# EAGLE schematic Atemfrequenzmesser_Schematic_V2 (EAGLE 9.6.2)
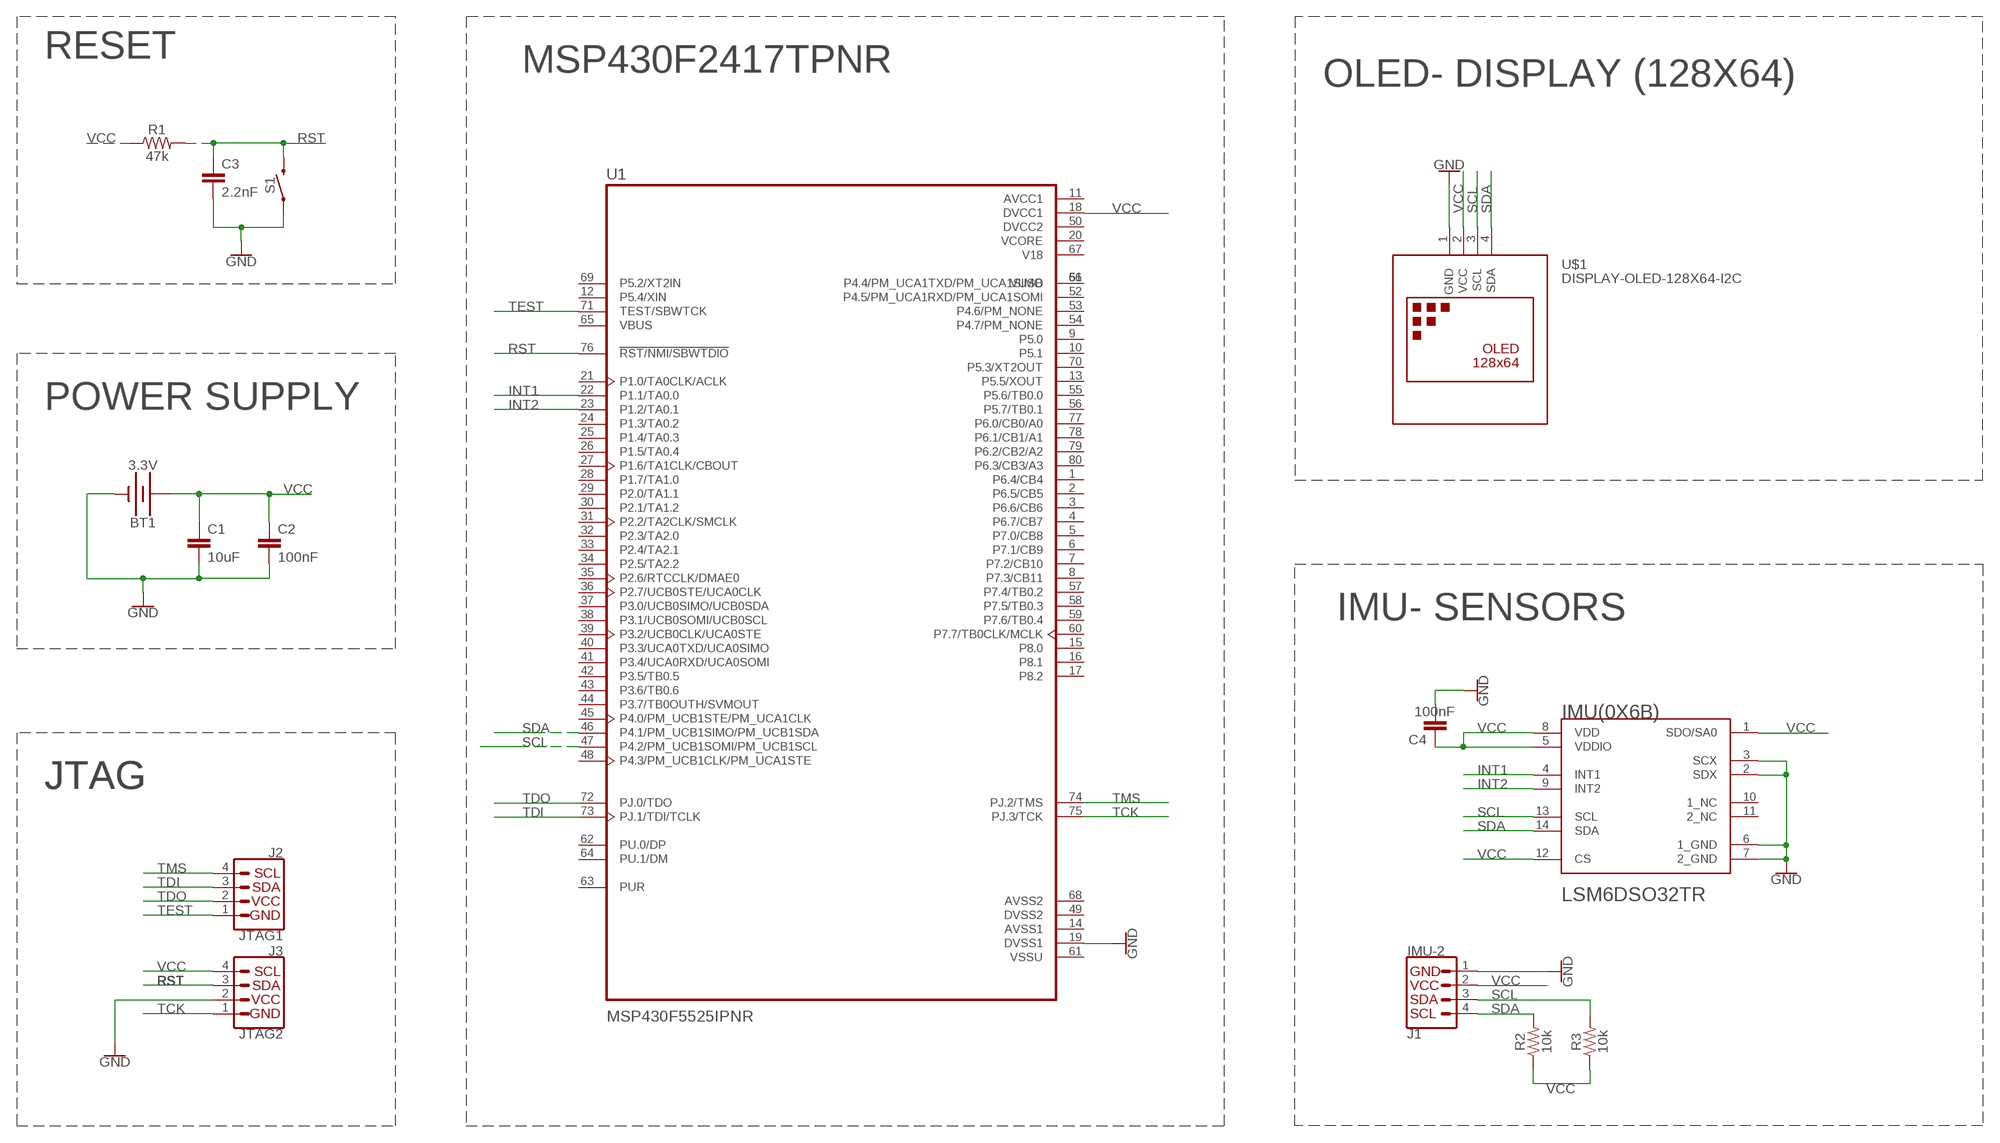
[diagram p0: schematic, sheet 1]

## Parts
BT1  3.3V  BATTERY-20MM_PTH  [BATTCOM_20MM_PTH]
C1  10uF  1.0PF-0603-50V-25%  [0603]
C2  100nF  1.0PF-0603-50V-25%  [0603]
C3  2.2nF  1.0PF-0603-50V-25%  [0603]
C4  100nF  1.0PF-0603-50V-25%  [0603]
IMU(0X6B)  STMICROELECTRONICS_LSM6DSO32TRSTMICROELECTRONICS_LSM6DSO32TR_0_0  [STMICROELECTRONICS_LSM6DSO32TR_0]
J1  IMU-2  I2C_STANDARDQWIIC  [JST04_1MM_RA]
J2  JTAG1  I2C_STANDARDQWIIC  [JST04_1MM_RA]
J3  JTAG2  I2C_STANDARDQWIIC  [JST04_1MM_RA]
R1  47k  1KOHM-0603-1/10W-1%  [0603]
R2  10k  1KOHM-0603-1/10W-1%  [0603]
R3  10k  1KOHM-0603-1/10W-1%  [0603]
S1  MOMENTARY-SWITCH-SPST-PTH-6.0MM  [TACTILE_SWITCH_PTH_6.0MM]
U1  MSP430F5525IPNR  MSP430F5519IPNR  [QFP50P1400X1400X160-80N]
U$1  DISPLAY-OLED-128X64-I2C  [DISPLAY-OLED-128X64-I2C]

## Nets
GND: BT1.2(-) C1.2 C2.2 C3.2 C4.2 IMU(0X6B).2(SDX) IMU(0X6B).3(SCX) IMU(0X6B).6(1_GND) IMU(0X6B).7(2_GND) J1.1 J3.2 S1.1 U1.19(DVSS1) U$1.1(GND)
INT1: IMU(0X6B).4(INT1) U1.22(P1.1/TA0.0)
INT2: IMU(0X6B).9(INT2) U1.23(P1.2/TA0.1)
RST: C3.1 J3.3 R1.2 S1.3 U1.76(!RST/NMI/SBWTDIO)
SCL: IMU(0X6B).13(SCL) J1.3 R3.2 U1.47(P4.2/PM_UCB1SOMI/PM_UCB1SCL) U$1.3(SCL)
SDA: IMU(0X6B).14(SDA) J1.4 R2.2 U1.46(P4.1/PM_UCB1SIMO/PM_UCB1SDA) U$1.4(SDA)
TCK: J3.1 U1.75(PJ.3/TCK)
TDI: J2.3 U1.73(PJ.1/TDI/TCLK)
TDO: J2.2 U1.72(PJ.0/TDO)
TEST: J2.1 U1.71(TEST/SBWTCK)
TMS: J2.4 U1.74(PJ.2/TMS)
VCC: BT1.1(+) C1.1 C2.1 C4.1 IMU(0X6B).1(SDO/SA0) IMU(0X6B).5(VDDIO) IMU(0X6B).8(VDD) IMU(0X6B).12(CS) J1.2 J3.4 R1.1 R2.1 R3.1 U1.18(DVCC1) U$1.2(VCC)
Unconnected: IMU(0X6B).10(1_NC) IMU(0X6B).11(2_NC) U1.1(P6.4/CB4) U1.2(P6.5/CB5) U1.3(P6.6/CB6) U1.4(P6.7/CB7) U1.5(P7.0/CB8) U1.6(P7.1/CB9) U1.7(P7.2/CB10) U1.8(P7.3/CB11) U1.9(P5.0) U1.10(P5.1) U1.12(P5.4/XIN) U1.13(P5.5/XOUT) U1.15(P8.0) U1.16(P8.1) U1.17(P8.2) U1.21(P1.0/TA0CLK/ACLK) U1.24(P1.3/TA0.2) U1.25(P1.4/TA0.3) U1.26(P1.5/TA0.4) U1.27(P1.6/TA1CLK/CBOUT) U1.28(P1.7/TA1.0) U1.29(P2.0/TA1.1) U1.30(P2.1/TA1.2) U1.31(P2.2/TA2CLK/SMCLK) U1.32(P2.3/TA2.0) U1.33(P2.4/TA2.1) U1.34(P2.5/TA2.2) U1.35(P2.6/RTCCLK/DMAE0) U1.36(P2.7/UCB0STE/UCA0CLK) U1.37(P3.0/UCB0SIMO/UCB0SDA) U1.38(P3.1/UCB0SOMI/UCB0SCL) U1.39(P3.2/UCB0CLK/UCA0STE) U1.40(P3.3/UCA0TXD/UCA0SIMO) U1.41(P3.4/UCA0RXD/UCA0SOMI) U1.42(P3.5/TB0.5) U1.43(P3.6/TB0.6) U1.44(P3.7/TB0OUTH/SVMOUT) U1.45(P4.0/PM_UCB1STE/PM_UCA1CLK) U1.48(P4.3/PM_UCB1CLK/PM_UCA1STE) U1.51(P4.4/PM_UCA1TXD/PM_UCA1SIMO) U1.52(P4.5/PM_UCA1RXD/PM_UCA1SOMI) U1.53(P4.6/PM_NONE) U1.54(P4.7/PM_NONE) U1.55(P5.6/TB0.0) U1.56(P5.7/TB0.1) U1.57(P7.4/TB0.2) U1.58(P7.5/TB0.3) U1.59(P7.6/TB0.4) U1.60(P7.7/TB0CLK/MCLK) U1.62(PU.0/DP) U1.63(PUR) U1.64(PU.1/DM) U1.65(VBUS) U1.66(VUSB) U1.69(P5.2/XT2IN) U1.70(P5.3/XT2OUT) U1.77(P6.0/CB0/A0) U1.78(P6.1/CB1/A1) U1.79(P6.2/CB2/A2) U1.80(P6.3/CB3/A3)

## Notes on the sheet
- RESET
- MSP430F2417TPNR
- OLED- DISPLAY (128X64)
- POWER SUPPLY
- IMU- SENSORS
- JTAG | JTAG

## Power pins joined to a net without a drawn wire
AVCC1: U1.11(AVCC1)
AVSS1: U1.14(AVSS1)
AVSS2: U1.68(AVSS2)
DVCC2: U1.50(DVCC2)
DVSS2: U1.49(DVSS2)
V18: U1.67(V18)
VCORE: U1.20(VCORE)
VSSU: U1.61(VSSU)

## Library data of the parts
BT1 = SparkFun-Batteries1:BATTERY: Battery - Single Cell A variety of battery chemistries, sizes, and footprints. Device List: 20MM_PTH - Coin Cell Battery Holder - 20mm (PTH) <https://www.sparkfun.com/products/783> 6.8MM_PTH - Coin Cell Battery Holder - 6.8MM(SMD) <https://www.digikey.com/product-detail/en/seiko-instruments/MS621FE-FL11E/728-1057-ND/1889208?WT.srch=1&gclid=CNOQ5a6LzdQCFZS2wAodXCkE0g> 12MM_SMD - Coin Cell Battery Holder - 12mm (SMD) <https://www.sparkfun.com/products/10592> 12MM_PTH - Coin Cell Battery Holder - 12mm (PTH) <https://www.sparkfun.com/products/7948> 20MM_SMD - 20mm Coin Cell Battery Holder (SMD) (2 legs) Used on the Big Time Watch Kit <https://www.sparkfun.com/products/11734> 20MM_SMD_4LEGS - Coin Cell Battery Holder - 20mm (SMD) <https://www.sparkfun.com/products/11892> 20MM_SMD_4LEGS_OVERPASTE - Coin Cell Battery Holder - 20mm (SMD) <https://www.sparkfun.com/products/11892> (Over-paste on the legs) 24.5MM_PTH - Coin Cell Battery Holder - 24.5mm (PTH) <https://www.sparkfun.com/products/8863> 9V - 9V Battery Holder - PC Mount Used on the SparkFun SparkPunk Sound Kit <https://www.sparkfun.com/products/11177> and SparkFun SparkPunk Sequencer Kit <https://www.sparkfun.com/products/12707> 18650 - Battery Holder - 18650 (PTH) <https://www.sparkfun.com/products/13113> AA - Battery Holder - 1xAA (PTH) <https://www.sparkfun.com/products/7949> AAA - Battery Holder - 1xAAA (PTH) <https://www.sparkfun.com/products/12718> AA_KIT - Battery Holder - 1xAA (PTH) <https://www.sparkfun.com/products/7949> Special kit package - pads only have exposed copper on one side of the board. AAA_KIT - Battery Holder - 1xAAA (PTH) <https://www.sparkfun.com/products/12718> Special kit package - pads only have exposed copper on one side of the board.; PROD_ID: BATT-09031; SF_SKU: PRT-00783
C1-C4 = SparkFun-Capacitors:1.0PF: 1pF ceramic capacitors A capacitor is a passive two-terminal electrical component used to store electrical energy temporarily in an electric field.; PROD_ID: CAP-07879; VALUE: 1.0pF
IMU(0X6B) = STMicroelectronics - LSM6DSO32TR:STMICROELECTRONICS_LSM6DSO32TR: Accelerometer, Gyroscope, Temperature, 6 Axis Sensor I²C, SPI Output; ACCEL_RANGE: 4/8/16/32g; AUTOMOTIVE: No; CENTROID_NOT_SPECIFIED: No; DATASHEET: https://eu.mouser.com/datasheet/2/389/dm00603953-1862087.pdf; DEVICE_CLASS_L1: Sensors; DEVICE_CLASS_L2: Motion Sensors; DEVICE_CLASS_L3: Inertial Measurement Units (IMUs); DIGIKEY_DESCRIPTION: INEMO INERTIAL MODULE: 3D ACCELE; DIGIKEY_PART_NUMBER: 497-LSM6DSO32CT-ND; FOOTPRINT_VARIANT_NAME_0: Recommended_Land_Pattern; HEIGHT: 0.86mm; LEAD_FREE: Yes; MAX_SUPPLY_VOLTAGE: 3.6V; MF: STMicroelectronics; MFG_PACKAGE_IDENT: LGA-14L-DM00249496; MFG_PACKAGE_IDENT_COMPONENT_ID: 648051b55531c14c; MFG_PACKAGE_IDENT_DATE: 0; MFG_PACKAGE_IDENT_REV: 1; MIN_SUPPLY_VOLTAGE: 1.62V; MOUSER_DESCRIPTION: Accelerometer and 3D Gyroscope 3D Always-On 1.71V to 3.6V 0.55mA 14-Pin LGA T/R; MOUSER_PART_NUMBER: 511-LSM6DSO32TR; MPN: LSM6DSO32TR; OPERATING_SUPPLY_CURRENT: 0.55mA; PACKAGE: LGA14; PREFIX: U; RESOLUTION: 16bits; ROHS: Yes; SENSOR_OUTPUT: I2C,SPI; SENSOR_TYPE: Temperature,Accelerometer,Gyroscope; TEMPERATURE_RANGE_HIGH: +85°C; TEMPERATURE_RANGE_LOW: -40°C; VERIFICATION_VERSION: 0.0.0.3
J1-J3 = SparkFun-Connectors:I2C_STANDARD: SparkFun I2C Standard Pinout Header SparkFun has standardized on a pinout for all I2C based sensor breakouts. This pinout allows I2C boards to be plugged directly into the headers on Arduino Uno compatible boards, and to be daisy chained easily. Example SparkFun Products: SparkFun Atmospheric Sensor Breakout - BME280 <https://www.sparkfun.com/products/13676> SparkFun Altitude/Pressure Sensor Breakout - MPL3115A2 <https://www.sparkfun.com/products/11084> SparkFun TOF Range Finder Sensor - VL6180 <https://www.sparkfun.com/products/12785>; PROD_ID: CONN-13694; VALUE: Qwiic Right Angle
R1-R3 = SparkFun-Resistors:1KOHM: 1kΩ resistor A resistor is a passive two-terminal electrical component that implements electrical resistance as a circuit element. Resistors act to reduce current flow, and, at the same time, act to lower voltage levels within circuits. - Wikipedia; PROD_ID: RES-07856; VALUE: 1k
S1 = SparkFun-Switches1:MOMENTARY-SWITCH-SPST: Momentary Switch (Pushbutton) - SPST Normally-open (NO) SPST momentary switches (buttons, pushbuttons). Variants PTH-12MM - 12mm square, through-hole Momentary Pushbutton Switch - 12mm Square <https://www.sparkfun.com/products/9190> (COM-09190) PTH-6.0MM, PTH-6.0MM-KIT - 6.0mm square, through-hole Mini Pushbutton Switch <https://www.sparkfun.com/products/97> (COM-00097) KIT package intended for soldering kit's - only one side of pads' copper is exposed. PTH-RIGHT-ANGLE-KIT - Right-angle, through-hole Right Angle Tactile Button <https://www.sparkfun.com/products/10791> - Used on SparkFun BigTime Watch Kit <https://www.sparkfun.com/products/11734> SMD-12MM - 12mm square, surface-mount Tactile Button - SMD (12mm) <https://www.sparkfun.com/products/12993> (COM-12993) Used on SparkFun PicoBoard <https://www.sparkfun.com/products/11888> SMD-4.5MM - 4.5mm Square Trackball Switch Used on SparkFun Blackberry Trackballer Breakout <https://www.sparkfun.com/products/13169> SMD-4.6MMX2.8MM - 4.60mm x 2.80mm, surface mount Used on SparkFun SAMD21 Mini Breakout <https://www.sparkfun.com/products/13664> SMD-5.2MM, SMD-5.2-REDUNDANT - 5.2mm square, surface-mount Mini Pushbutton Switch - SMD <https://www.sparkfun.com/products/8720> (COM-08720) Used on Arduino Pro Mini <https://www.sparkfun.com/products/11114> REDUNDANT package connects both switch circuits together SMD-6.0X3.5MM - 6.0 x 3.5mm, surface mount Momentary Reset Switch SMD <https://www.sparkfun.com/products/8229> (COM-08229) SMD-6.2MM-TALL - 6.2mm square, surface mount Tactile Button - SMD (6mm) <https://www.sparkfun.com/products/12992> Used on SparkFun Digital Sandbox <https://www.sparkfun.com/products/12651> SMD-RIGHT-ANGLE - Right-angle, surface mount Used on SparkFun Block for Intel® Edison - Arduino <https://www.sparkfun.com/products/13036>; PROD_ID: SWCH-08441; SF_SKU: COM-00097
U1 = MSP430F5519IPNR:MSP430F5519IPNR: Check prices <https://pricing.snapeda.com/parts/MSP430F5519IPNR/Texas%20Instruments/view-part?ref=eda>; AVAILABILITY: In Stock; DESCRIPTION: 25 MHz MCU with 128KB Flash, 8KB SRAM, Comparator, DMA, UART/SPI/I2C, USB, Timer, HW Multiplier 80-LQFP -40 to 85; MF: Texas Instruments; MP: MSP430F5519IPNR; PACKAGE: LQFP-80 Texas Instruments; PRICE: None; PURCHASE-URL: https://pricing.snapeda.com/search/part/MSP430F5519IPNR/?ref=eda
U$1 = ahmet:DISPLAY-OLED-128X64-I2C: 128x64 Dot Matrix OLED Module based on SSD1306 chip Variant with I2C interface More details available here: http://www.instructables.com/id/Monochrome-096-i2c-OLED-display-with-arduino-SSD13/ SSD1306 datasheet: https://cdn-shop.adafruit.com/datasheets/SSD1306.pdf Click here to find device on ebay.com <http://www.ebay.com/sch/oled+display+128x64+iic> Note: There are two variants: I2C and SPI. Search for the proper version.

## Net classes
0 default: width 0 mm, drill 0 mm